# Altium project FYP_POWERBOARD_60V100A_REV2.PrjPCB
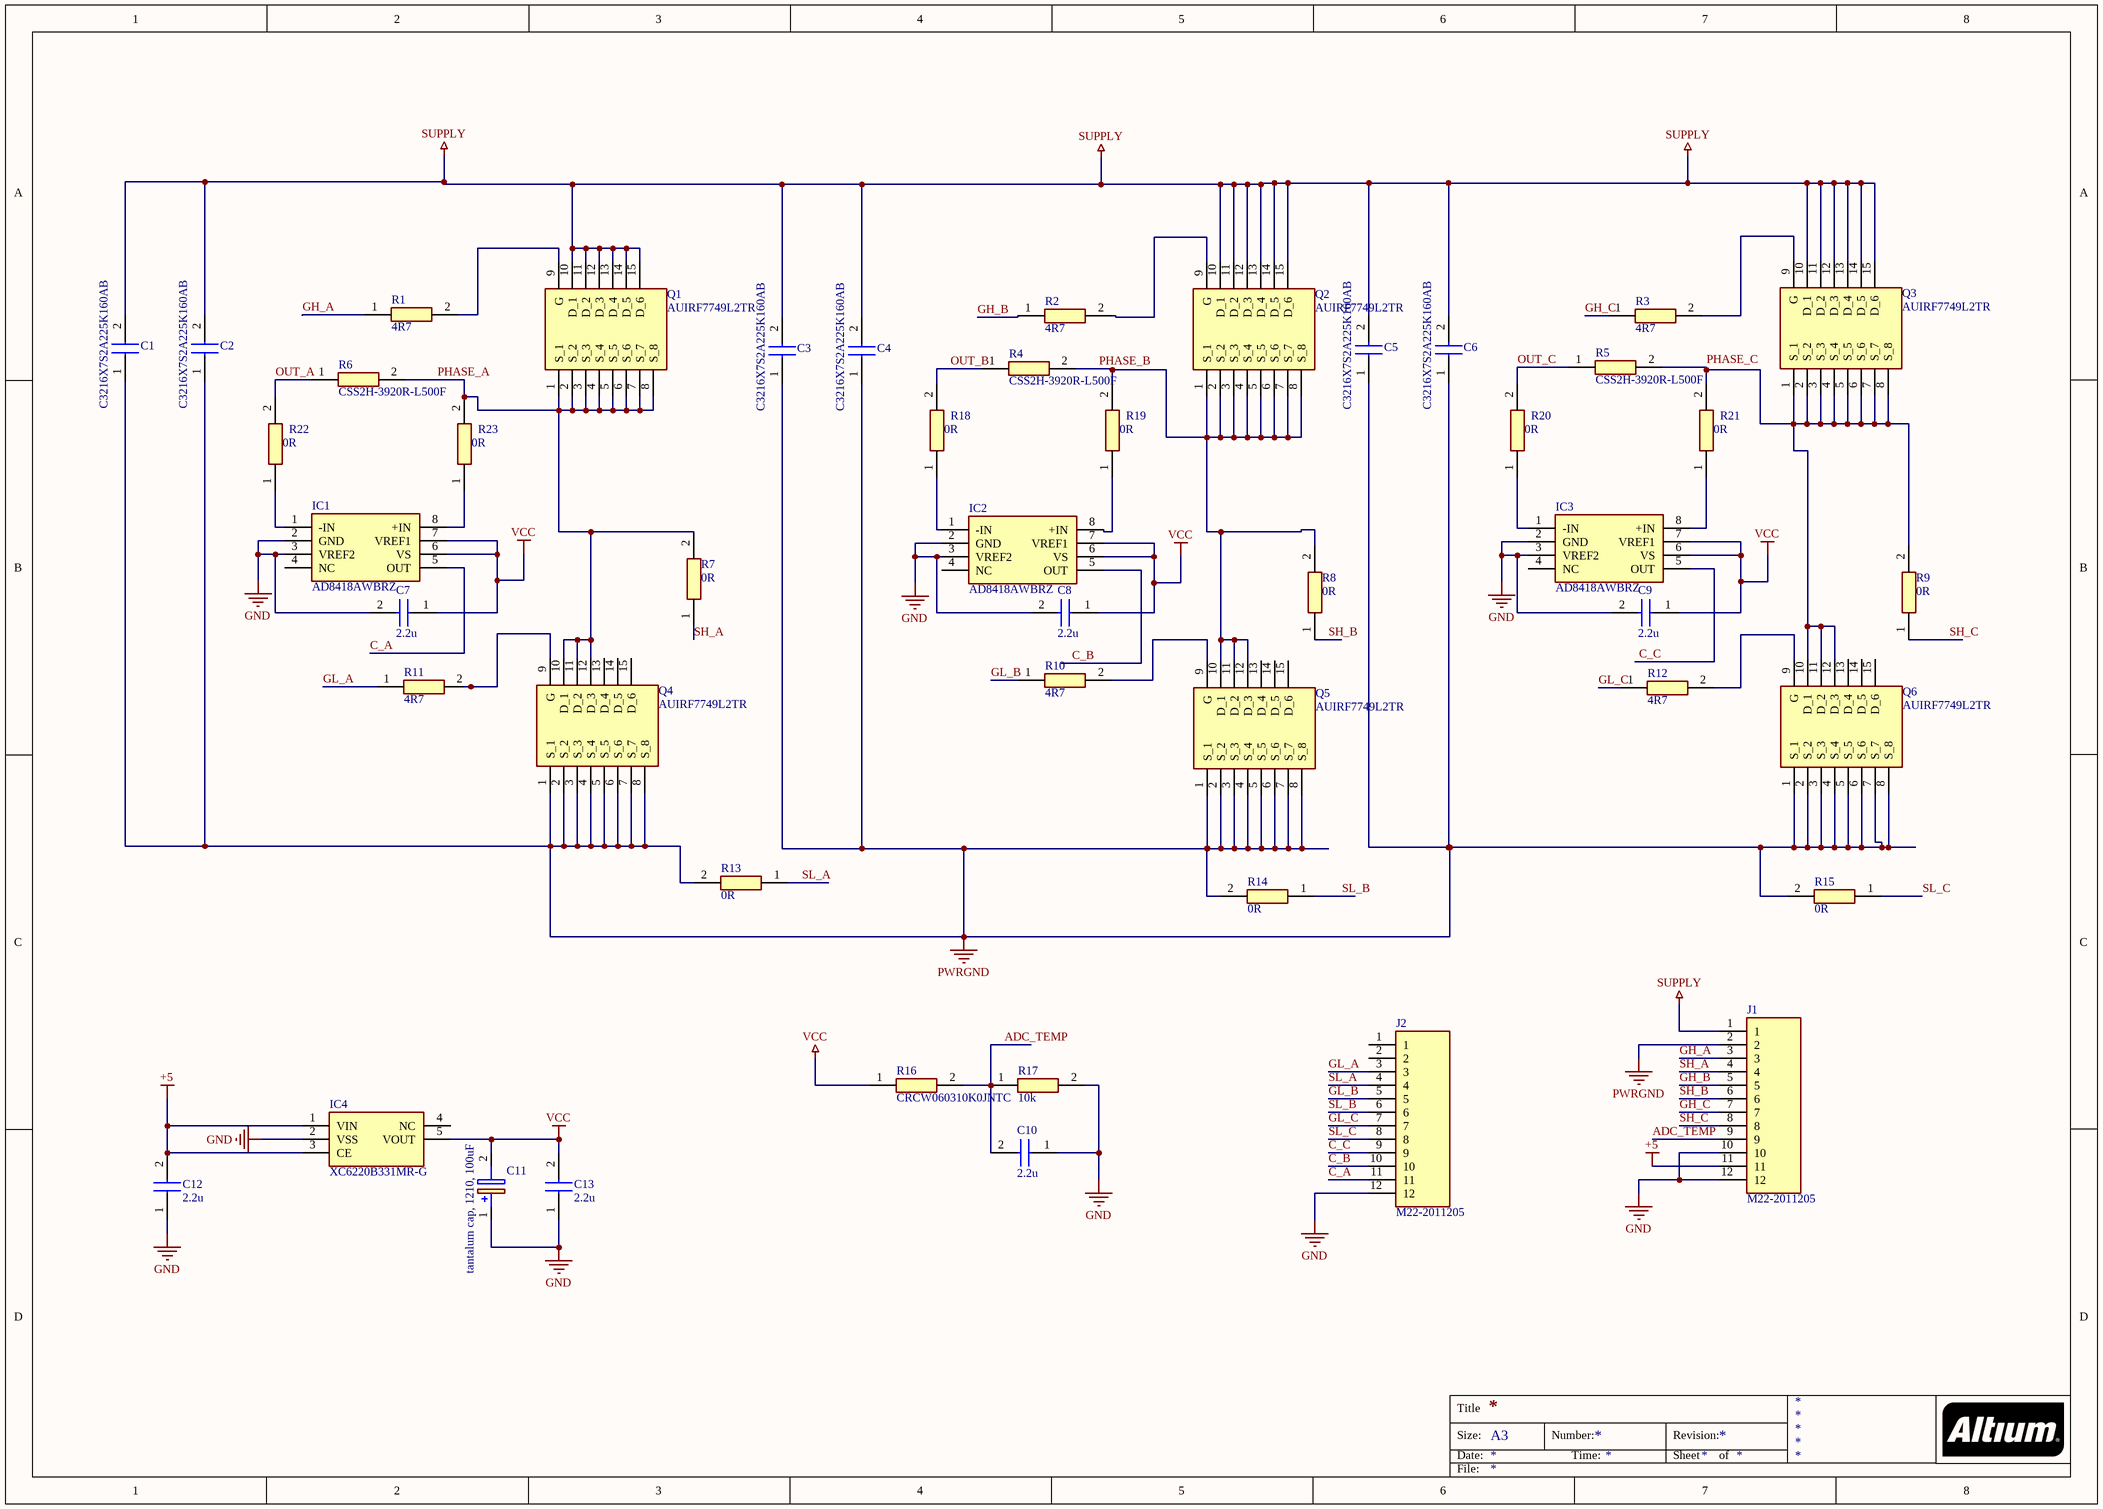
[diagram p0: FYP_POWERBOARD_60V100A_REV2.SchDoc]
1 sheet, 48 parts. Net scope: global (net labels, ports and power ports of the same name join across sheets).
Board file: FYP_POWERBOARD_60V100A_REV2.PcbDoc

## Sheet FYP_POWERBOARD_60V100A_REV2.SchDoc
size A3

### Parts
C1  C3216X7S2A225K160AB  [CAPC3216X180N]
C2  C3216X7S2A225K160AB  [CAPC3216X180N]
C3  C3216X7S2A225K160AB  [CAPC3216X180N]
C4  C3216X7S2A225K160AB  [CAPC3216X180N]
C5  C3216X7S2A225K160AB  [CAPC3216X180N]
C6  C3216X7S2A225K160AB  [CAPC3216X180N]
C7  2.2u  [CAPC1608X90N]
C8  2.2u  [CAPC1608X90N]
C9  2.2u  [CAPC1608X90N]
C10  2.2u  [CAPC1608X90N]
C11  tantalum cap, 1210, 100uF  [CAPPM3528X210N]
C12  2.2u  [CAPC1608X90N]
C13  2.2u  [CAPC1608X90N]
IC1  AD8418AWBRZ  [SOP65P490X110-8N]
IC2  AD8418AWBRZ  [SOP65P490X110-8N]
IC3  AD8418AWBRZ  [SOP65P490X110-8N]
IC4  XC6220B331MR-G  [SOT95P280X120-5N]
J1  M22-2011205  [HDRV12W60P0X200_1X12_2415X200X525P]
J2  M22-2011205  [HDRV12W60P0X200_1X12_2415X200X525P]
Q1  AUIRF7749L2TR  [IRF7749L2TRPBF]
Q2  AUIRF7749L2TR  [IRF7749L2TRPBF]
Q3  AUIRF7749L2TR  [IRF7749L2TRPBF]
Q4  AUIRF7749L2TR  [IRF7749L2TRPBF]
Q5  AUIRF7749L2TR  [IRF7749L2TRPBF]
Q6  AUIRF7749L2TR  [IRF7749L2TRPBF]
R1  4R7  [RESC1608X55N]
R2  4R7  [RESC1608X55N]
R3  4R7  [RESC1608X55N]
R4  CSS2H-3920R-L500F  [RESC10052X137N]
R5  CSS2H-3920R-L500F  [RESC10052X137N]
R6  CSS2H-3920R-L500F  [RESC10052X137N]
R7  0R  [RESC1608X55N]
R8  0R  [RESC1608X55N]
R9  0R  [RESC1608X55N]
R10  4R7  [RESC1608X55N]
R11  4R7  [RESC1608X55N]
R12  4R7  [RESC1608X55N]
R13  0R  [RESC1608X55N]
R14  0R  [RESC1608X55N]
R15  0R  [RESC1608X55N]
R16  CRCW060310K0JNTC  [RESC1608X50N]
R17  10k  [RESC1608X55N]
R18  0R  [RESC1608X55N]
R19  0R  [RESC1608X55N]
R20  0R  [RESC1608X55N]
R21  0R  [RESC1608X55N]
R22  0R  [RESC1608X55N]
R23  0R  [RESC1608X55N]

### Nets
+5: C12.2 IC4.1(VIN) IC4.3(CE) J1.11
GND: C7.2 C8.2 C9.2 C10.1 C11.1(+) C12.1 C13.1 IC1.2(GND) IC1.3(VREF2) IC2.2(GND) IC2.3(VREF2) IC3.2(GND) IC3.3(VREF2) IC4.2(VSS) J1.10 J1.12 J2.12 R17.2
PWRGND: C1.1 C2.1 C3.1 C4.1 C5.1 C6.1 J1.2 Q4.1(S_1) Q4.2(S_2) Q4.3(S_3) Q4.4(S_4) Q4.5(S_5) Q4.6(S_6) Q4.7(S_7) Q4.8(S_8) Q5.1(S_1) Q5.2(S_2) Q5.3(S_3) Q5.4(S_4) Q5.5(S_5) Q5.6(S_6) Q5.7(S_7) Q5.8(S_8) Q6.1(S_1) Q6.2(S_2) Q6.3(S_3) Q6.4(S_4) Q6.5(S_5) Q6.6(S_6) Q6.7(S_7) Q6.8(S_8) R13.2 R14.2 R15.2
SUPPLY: C1.2 C2.2 C3.2 C4.2 C5.2 C6.2 J1.1 Q1.10(D_1) Q1.11(D_2) Q1.12(D_3) Q1.13(D_4) Q1.14(D_5) Q1.15(D_6) Q2.10(D_1) Q2.11(D_2) Q2.12(D_3) Q2.13(D_4) Q2.14(D_5) Q2.15(D_6) Q3.10(D_1) Q3.11(D_2) Q3.12(D_3) Q3.13(D_4) Q3.14(D_5) Q3.15(D_6)
VCC: C7.1 C8.1 C9.1 C11.2(-) C13.2 IC1.6(VS) IC1.7(VREF1) IC2.6(VS) IC2.7(VREF1) IC3.6(VS) IC3.7(VREF1) IC4.5(VOUT) R16.1
ADC_TEMP: C10.2 J1.9 R16.2 R17.1
C_A: IC1.5(OUT) J2.11
C_B: IC2.5(OUT) J2.10
C_C: IC3.5(OUT) J2.9
GH_A: J1.3 R1.1
GH_B: J1.5 R2.1
GH_C: J1.7 R3.1
GL_A: J2.3 R11.1
GL_B: J2.5 R10.1
GL_C: J2.7 R12.1
OUT_A: R6.1 R22.2
OUT_B: R4.1 R18.2
OUT_C: R5.1 R20.2
PHASE_A: Q1.1(S_1) Q1.2(S_2) Q1.3(S_3) Q1.4(S_4) Q1.5(S_5) Q1.6(S_6) Q1.7(S_7) Q1.8(S_8) Q4.10(D_1) Q4.11(D_2) Q4.12(D_3) R6.2 R7.2 R23.2
PHASE_B: Q2.1(S_1) Q2.2(S_2) Q2.3(S_3) Q2.4(S_4) Q2.5(S_5) Q2.6(S_6) Q2.7(S_7) Q2.8(S_8) Q5.10(D_1) Q5.11(D_2) Q5.12(D_3) R4.2 R8.2 R19.2
PHASE_C: Q3.1(S_1) Q3.2(S_2) Q3.3(S_3) Q3.4(S_4) Q3.5(S_5) Q3.6(S_6) Q3.7(S_7) Q3.8(S_8) Q6.10(D_1) Q6.11(D_2) Q6.12(D_3) R5.2 R9.2 R21.2
SH_A: J1.4 R7.1
SH_B: J1.6 R8.1
SH_C: J1.8 R9.1
SL_A: J2.4 R13.1
SL_B: J2.6 R14.1
SL_C: J2.8 R15.1
NetIC1_1: IC1.1(-IN) R22.1
NetIC1_8: IC1.8(+IN) R23.1
NetIC2_1: IC2.1(-IN) R18.1
NetIC2_8: IC2.8(+IN) R19.1
NetIC3_1: IC3.1(-IN) R20.1
NetIC3_8: IC3.8(+IN) R21.1
NetQ1_9: Q1.9(G) R1.2
NetQ2_9: Q2.9(G) R2.2
NetQ3_9: Q3.9(G) R3.2
NetQ4_9: Q4.9(G) R11.2
NetQ5_9: Q5.9(G) R10.2
NetQ6_9: Q6.9(G) R12.2

Not connected (* = marked no-connect by the designer): IC1 4(NC); IC2 4(NC); IC3 4(NC); IC4 4(NC); J2 1 2; Q4 13(D_4) 14(D_5) 15(D_6); Q5 13(D_4) 14(D_5) 15(D_6); Q6 13(D_4) 14(D_5) 15(D_6)

### Notes on the sheet
- Title
- Size:
- Date:
- A3
- Number:
- Time:
- Revision:
- Sheet
- of
- File:

### Library data of the parts
C1-C6 = C3216X7S2A225K160AB: Capacitor; Manufacturer_Name: TDK; Datasheet Link: https://product.tdk.com/info/en/catalog/datasheets/mlcc_commercial_midvoltage_en.pdf; Height: 1.8mm; Manufacturer_Part_Number: C3216X7S2A225K160AB; Mouser Part Number: 810-C3216X7S2A225K; Mouser Price/Stock: https://www.mouser.com/Search/Refine.aspx?Keyword=810-C3216X7S2A225K; RS Part Number: 7883079P; RS Price/Stock: http://uk.rs-online.com/web/p/products/7883079P
C7-C10 C12 C13 = GCM188R70J225KE22D: Capacitor; Manufacturer_Name: Murata Electronics; Datasheet Link: https://psearch.en.murata.com/capacitor/product/GCM188R70J225KE22%23.pdf; Height: 0.9mm; Manufacturer_Part_Number: GCM188R70J225KE22D; Mouser Part Number: 81-GCM188R70J225KE2D; Mouser Price/Stock: https://www.mouser.com/Search/Refine.aspx?Keyword=81-GCM188R70J225KE2D; RS Part Number: 8151272P; RS Price/Stock: http://uk.rs-online.com/web/p/products/8151272P
C11 = 293D107X06R3B2TE3: Capacitor Polarised; Manufacturer_Name: Vishay; Datasheet Link: http://www.vishay.com/docs/40002/293d.pdf; Height: 2.1mm; Manufacturer_Part_Number: 293D107X06R3B2TE3; Mouser Part Number: N/A; Mouser Price/Stock: https://www.mouser.com/Search/Refine.aspx?Keyword=N%2FA
IC1-IC3 = AD8418AWBRZ: Integrated Circuit; Manufacturer_Name: Analog Devices; Datasheet Link: http://www.analog.com/media/en/technical-documentation/data-sheets/AD8418A.pdf; Height: 1.1mm; Manufacturer_Part_Number: AD8418AWBRZ; Mouser Part Number: 584-AD8418AWBRZ; Mouser Price/Stock: https://www.mouser.com/Search/Refine.aspx?Keyword=584-AD8418AWBRZ; RS Part Number: 7989903; RS Price/Stock: https://uk.rs-online.com/web/p/products/7989903
IC4 = XC6220B331MR-G: Integrated Circuit; Manufacturer_Name: Torex; Datasheet Link: https://media.digikey.com/pdf/Data%20Sheets/Torex/XC6220.pdf; Height: 1.2mm; Manufacturer_Part_Number: XC6220B331MR-G; Mouser Part Number: 865-XC6220B331MR-G; Mouser Price/Stock: https://www.mouser.com/Search/Refine.aspx?Keyword=865-XC6220B331MR-G
J1 J2 = M22-2011205: Connector; Manufacturer_Name: HARWIN; Datasheet Link: https://cdn.harwin.com/pdfs/M22-201.pdf; Height: 5.25mm; Manufacturer_Part_Number: M22-2011205; Mouser Part Number: 855-M22-2011205; Mouser Price/Stock: https://www.mouser.com/Search/Refine.aspx?Keyword=855-M22-2011205; RS Part Number: 1730943; RS Price/Stock: https://uk.rs-online.com/web/p/products/1730943; System: Connector
Q1-Q6 = AUIRF7749L2TR: MOSFET (N-Channel); Manufacturer_Name: Infineon; Datasheet Link: https://www.mouser.com/datasheet/2/196/auirf7749l2-1225782.pdf; Height: 1mm; Manufacturer_Part_Number: AUIRF7749L2TR; Mouser Part Number: 942-AUIRF7749L2TR; Mouser Price/Stock: https://www.mouser.com/Search/Refine.aspx?Keyword=942-AUIRF7749L2TR
R1-R3 R7-R15 R17-R23 = CPF0603B100RE: Resistor; Manufacturer_Name: TE Connectivity; Allied_Number: 70286645; Datasheet Link: http://www.farnell.com/datasheets/1786775.pdf; Height: 0.55mm; Manufacturer_Part_Number: CPF0603B100RE; Mouser Part Number: 279-CPF0603B100RE; Mouser Price/Stock: https://www.mouser.com/Search/Refine.aspx?Keyword=279-CPF0603B100RE; RS Part Number: 6661951P; RS Price/Stock: http://uk.rs-online.com/web/p/products/6661951P; Allied Price/Stock: https://www.alliedelec.com/te-connectivity-cpf0603b100re/70286645/
R4-R6 = CSS2H-3920R-L500F: Resistor; Manufacturer_Name: Bourns; Allied_Number: 70883778; Datasheet Link: https://componentsearchengine.com/Datasheets/2/CSS2H-3920R-L500F.pdf; Height: 1.37mm; Manufacturer_Part_Number: CSS2H-3920R-L500F; Mouser Part Number: 652-CSS2H3920RL500F; Mouser Price/Stock: https://www.mouser.com/Search/Refine.aspx?Keyword=652-CSS2H3920RL500F; RS Part Number: 1348150; RS Price/Stock: http://uk.rs-online.com/web/p/products/1348150; Allied Price/Stock: https://www.alliedelec.com/bourns-css2h-3920r-l500f/70883778/
R16 = CRCW060310K0JNTC: Resistor; Manufacturer_Name: Vishay; Datasheet Link: http://www.vishay.com/docs/20035/dcrcwe3.pdf; Height: 0.5mm; Manufacturer_Part_Number: CRCW060310K0JNTC